# Altium schematic sheet mcu.SchDoc
size A4
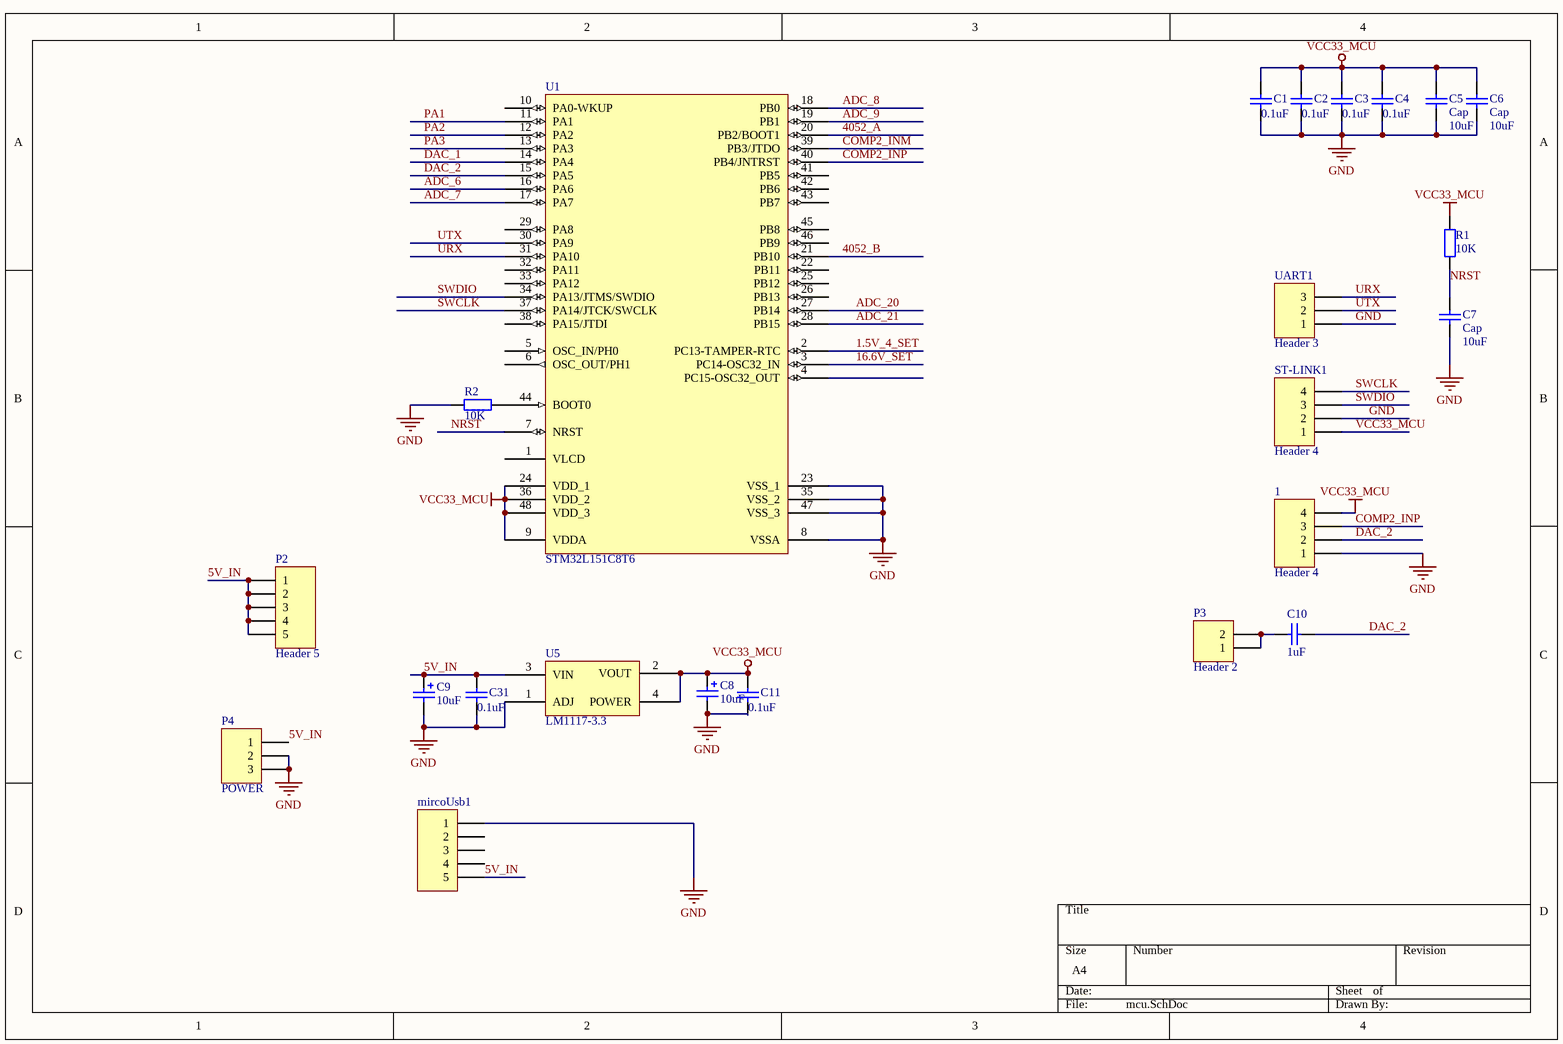
[diagram p0: mcu.SchDoc]

## Parts
1  Header 4  [HDR1X4]
C1  value 0.1uF  [c0805]  (hidden comment: Cap)
C2  value 0.1uF  [c0805]  (hidden comment: Cap)
C3  value 0.1uF  [c0805]  (hidden comment: Cap)
C4  value 0.1uF  [c0805]  (hidden comment: Cap)
C5  Cap  value 10uF  [c0805]
C6  Cap  value 10uF  [c0805]
C7  Cap  value 10uF  [c0805]
C8  value 10uF  [C1206]  (hidden comment: Cap Pol2)
C9  value 10uF  [C1206]  (hidden comment: Cap Pol2)
C10  value 1uF  [0805]  (hidden comment: Cap)
C11  value 0.1uF  [0805]  (hidden comment: Cap)
C31  value 0.1uF  [0805]  (hidden comment: Cap)
mircoUsb1  (no value)  [Micro_USB]
P2  Header 5  [HDR1X5]
P3  Header 2  [HDR1X2]
P4  POWER  [POWER_PLUG]
R1  value 10K  [0805]  (hidden comment: Res2)
R2  value 10K  [0805]  (hidden comment: Res2)
ST-LINK1  Header 4  [HDR1X4]
U1  STM32L151C8T6  [LQFP48_N]
U5  LM1117-3.3  [SOT223]
UART1  Header 3  [HDR1X3]

## Nets
GND: 1.1 C1.1 C2.1 C3.1 C4.1 C5.1 C6.1 C7.1 C8.2 C9.2 C11.1 C31.1 mircoUsb1.1 P4.2 P4.3 R2.1 ST-LINK1.2 U1.8(VSSA) U1.23(VSS_1) U1.35(VSS_2) U1.47(VSS_3) U5.1(ADJ) UART1.1
VCC33_MCU: 1.4 C1.2 C2.2 C3.2 C4.2 C5.2 C6.2 C8.1 C11.2 R1.1 ST-LINK1.1 U1.9(VDDA) U1.24(VDD_1) U1.36(VDD_2) U1.48(VDD_3) U5.2(VOUT) U5.4(POWER)
1.5V_4_SET: U1.2(PC13-TAMPER-RTC)
5V_IN: C9.1 C31.2 mircoUsb1.5 P2.1 P2.2 P2.3 P2.4 P2.5 P4.1 U5.3(VIN)
16.6V_SET: U1.3(PC14-OSC32_IN)
4052_A: U1.20(PB2/BOOT1)
4052_B: U1.21(PB10)
ADC_6: U1.16(PA6)
ADC_7: U1.17(PA7)
ADC_8: U1.18(PB0)
ADC_9: U1.19(PB1)
ADC_20: U1.27(PB14)
ADC_21: U1.28(PB15)
COMP2_INM: U1.39(PB3/JTDO)
COMP2_INP: 1.3 U1.40(PB4/JNTRST)
DAC_1: U1.14(PA4)
DAC_2: 1.2 C10.1 U1.15(PA5)
NRST: C7.2 R1.2 U1.7(NRST)
PA1: U1.11(PA1)
PA2: U1.12(PA2)
PA3: U1.13(PA3)
SWCLK: ST-LINK1.4 U1.37(PA14/JTCK/SWCLK)
SWDIO: ST-LINK1.3 U1.34(PA13/JTMS/SWDIO)
URX: U1.31(PA10) UART1.3
UTX: U1.30(PA9) UART1.2
NetC10_2: C10.2 P3.1 P3.2
NetR2_2: R2.2 U1.44(BOOT0)

Not connected (* = marked no-connect by the designer): mircoUsb1 2 3 4; U1 1(VLCD) 4(PC15-OSC32_OUT) 5(OSC_IN/PH0) 6(OSC_OUT/PH1) 10(PA0-WKUP) 22(PB11) 25(PB12) 26(PB13) 29(PA8) 32(PA11) 33(PA12) 38(PA15/JTDI) 41(PB5) 42(PB6) 43(PB7) 45(PB8) 46(PB9)

## Library data of the parts
1 ST-LINK1 = Header 4: Header, 4-Pin; LatestRevisionDate: 17-Jul-2002; LatestRevisionNote: Re-released for DXP Platform.; Publisher: Altium Limited
C1-C7 C10 C11 C31 = Cap: Capacitor; Published: 8-Jun-2000; LatestRevisionDate: 17-Jul-2002; LatestRevisionNote: Re-released for DXP Platform.; PackageReference: RAD-0.3; Publisher: Altium Limited
  C5-C7: PackageDescription: Radial Cap, Thru-Hole; 2 Leads; 0.3 in Pin Spacing
C8 C9 = Cap Pol2: Polarized Capacitor (Axial); Published: 8-Jun-2000; LatestRevisionDate: 17-Jul-2002; LatestRevisionNote: Re-released for DXP Platform.; PackageReference: POLAR0.8; Publisher: Altium Limited
mircoUsb1 P2 = Header 5: Header, 5-Pin; LatestRevisionDate: 17-Jul-2002; LatestRevisionNote: Re-released for DXP Platform.; Publisher: Altium Limited
P3 = Header 2: Header, 2-Pin; LatestRevisionDate: 17-Jul-2002; LatestRevisionNote: Re-released for DXP Platform.; Publisher: Altium Limited
R1 R2 = Res2: Resistor; Published: 8-Jun-2000; LatestRevisionDate: 17-Jul-2002; LatestRevisionNote: Re-released for DXP Platform.; PackageReference: AXIAL-0.4; Publisher: Altium Limited
U1 = STM32L151C8T6: STM32 ARM-based 32-bit MCU with 64 Kbytes Flash, 48-pin LQFP, Industrial Temperature; Published: 30-May-2008; DatasheetVersion: rev6, Mar-2008; PackageVersion: Mar-2008; PackageReference: LQFP48; Publisher: Altium Limited; PackageDescription: 48-Pin Low-Profile Quad Flat Pack, 7 x 7 mm Body, 0.5 mm Pitch (LQFP48); ComponentLink1Description: Manufacturer Link; ComponentLink1URL: www.st.com/stm32; ComponentLink2Description: Datasheet; ComponentLink2URL: http://www.st.com/stonline/products/literature/ds/13586.pdf
UART1 = Header 3: Header, 3-Pin; LatestRevisionDate: 17-Jul-2002; LatestRevisionNote: Re-released for DXP Platform.; Publisher: Altium Limited